# Altium schematic sheet Copy of uARM.SchDoc
size B
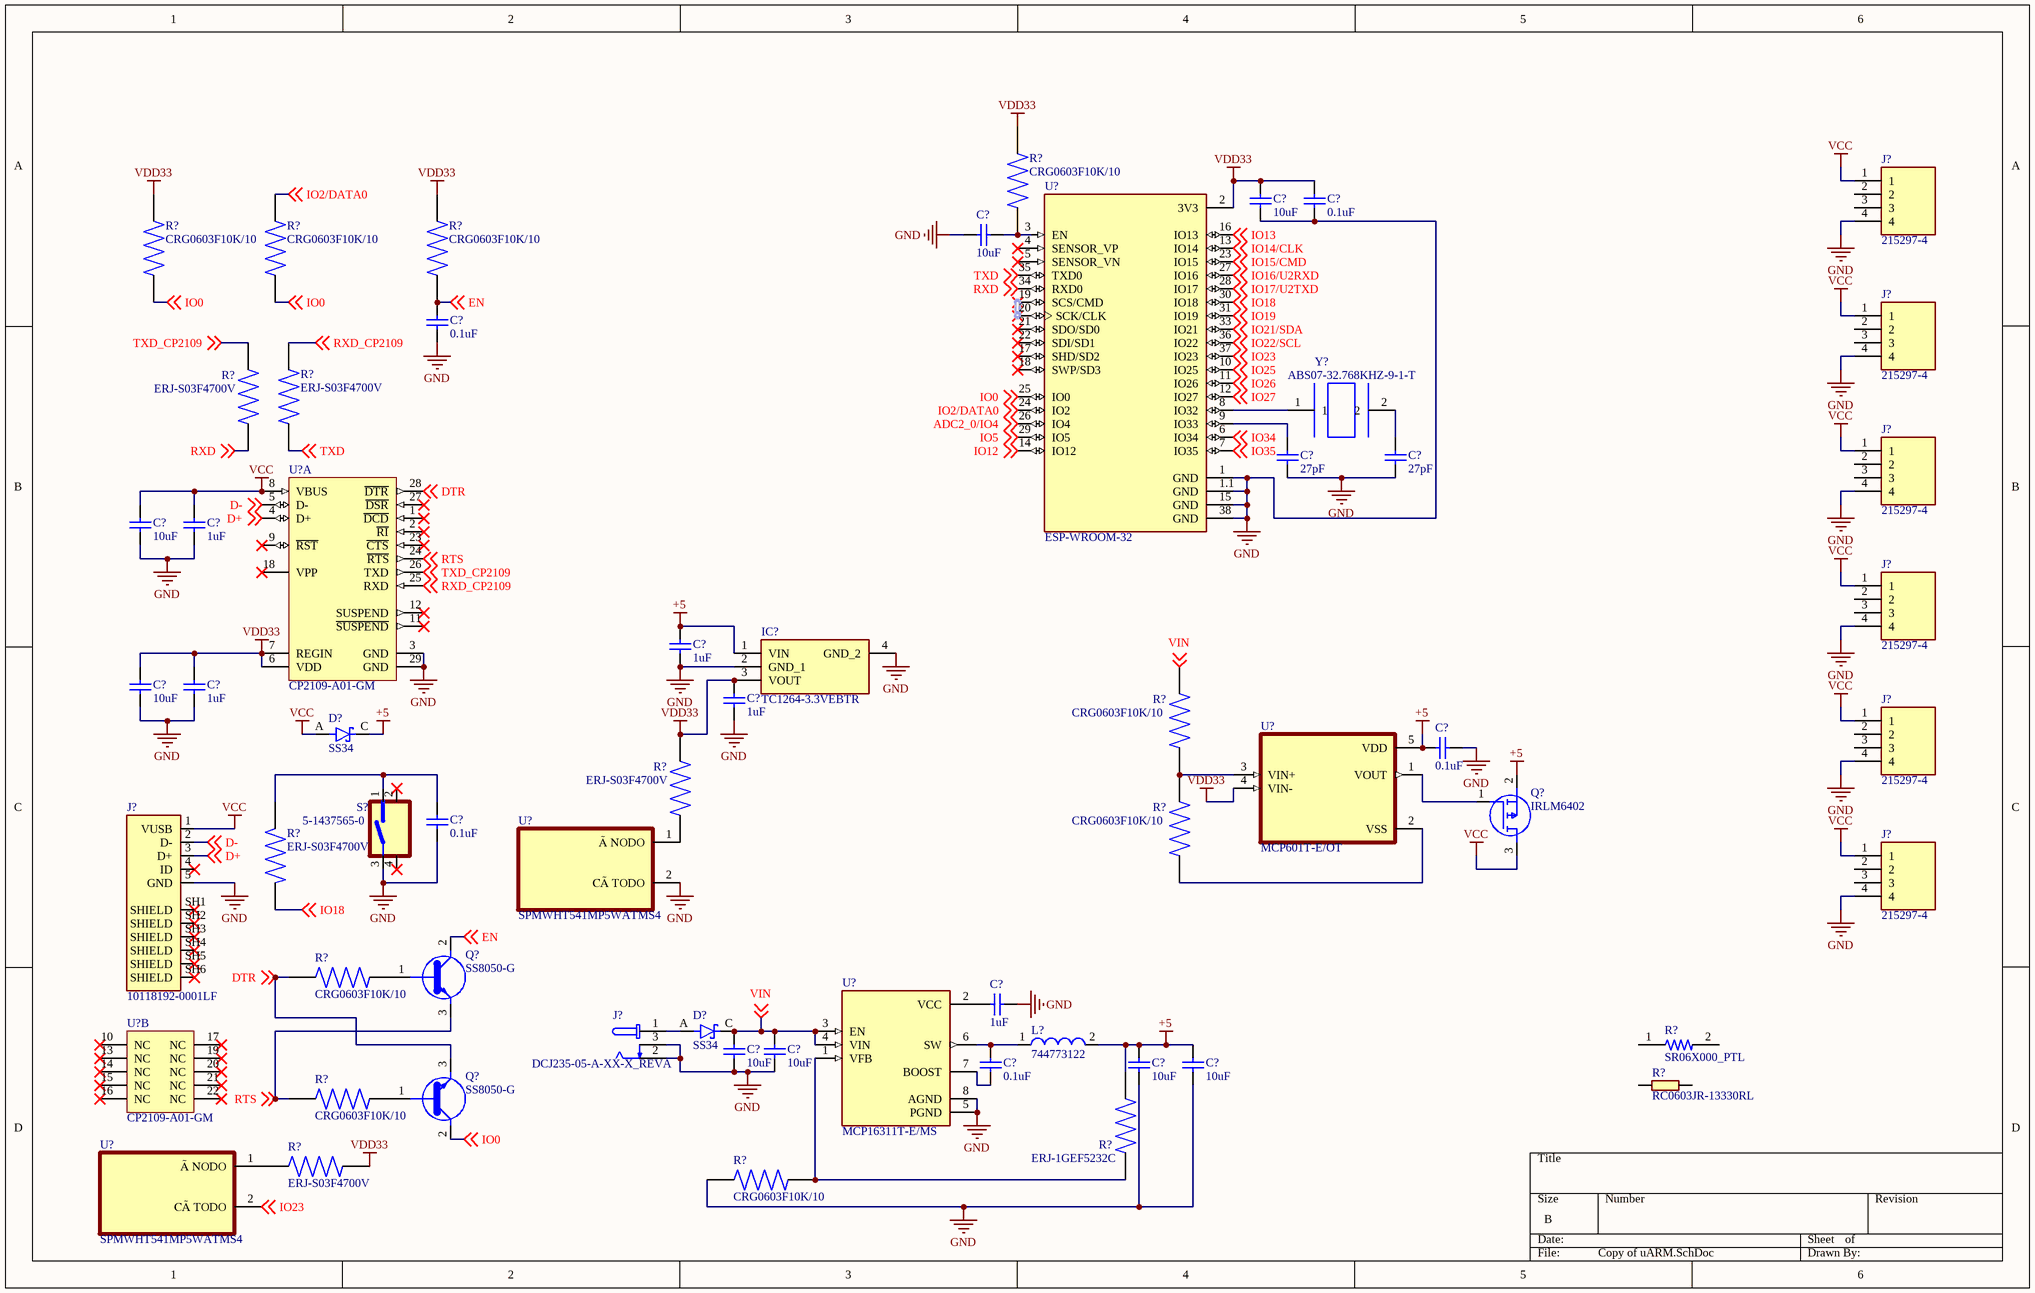
[diagram p0: Copy of uARM.SchDoc]

## Parts
(Parts that share a designator on the sheet are numbered #1, #2 ... from top to bottom, then left to right.)
C?#1  value 10uF  [C_3216[1206]_N]  (hidden comment: C1206C106K3RACTU)
C?#2  value 0.1uF  [C_3216[1206]_N]  (hidden comment: C1206C106K3RACTU)
C?#3  value 10uF  [C_3216[1206]_N]  (hidden comment: C1206C106K3RACTU)
C?#4  value 0.1uF  [C_3216[1206]_N]  (hidden comment: C1206C106K3RACTU)
C?#5  value 27pF  [C_3216[1206]_N]  (hidden comment: C1206C106K3RACTU)
C?#6  value 27pF  [C_3216[1206]_N]  (hidden comment: C1206C106K3RACTU)
C?#7  value 10uF  [C_3216[1206]_N]  (hidden comment: C1206C106K3RACTU)
C?#8  value 1uF  [C_3216[1206]_N]  (hidden comment: C1206C106K3RACTU)
C?#9  value 1uF  [C_3216[1206]_N]  (hidden comment: C1206C106K3RACTU)
C?#10  value 1uF  [C_3216[1206]_N]  (hidden comment: C1206C106K3RACTU)
C?#11  value 10uF  [C_3216[1206]_N]  (hidden comment: C1206C106K3RACTU)
C?#12  value 1uF  [C_3216[1206]_N]  (hidden comment: C1206C106K3RACTU)
C?#13  value 0.1uF  [C_3216[1206]_N]  (hidden comment: C1206C106K3RACTU)
C?#14  value 0.1uF  [C_3216[1206]_N]  (hidden comment: C1206C106K3RACTU)
C?#15  value 1uF  [C_3216[1206]_N]  (hidden comment: C1206C106K3RACTU)
C?#16  value 10uF  [C_3216[1206]_N]  (hidden comment: C1206C106K3RACTU)
C?#17  value 10uF  [C_3216[1206]_N]  (hidden comment: C1206C106K3RACTU)
C?#18  value 0.1uF  [C_3216[1206]_N]  (hidden comment: C1206C106K3RACTU)
C?#19  value 10uF  [C_3216[1206]_N]  (hidden comment: C1206C106K3RACTU)
C?#20  value 10uF  [C_3216[1206]_N]  (hidden comment: C1206C106K3RACTU)
D?#1  SS34  [DIOM7959X265N]
D?#2  SS34  [DIOM7959X265N]
IC?  TC1264-3.3VEBTR  [TC126433VEBTR]
J?#1  215297-4  [TE_215297-4]
J?#2  215297-4  [TE_215297-4]
J?#3  215297-4  [TE_215297-4]
J?#4  215297-4  [TE_215297-4]
J?#5  215297-4  [TE_215297-4]
J?#6  10118192-0001LF  [AMPHENOL_10118192-0001LF]
J?#7  215297-4  [TE_215297-4]
J?#8  DCJ235-05-A-XX-X_REVA  [GCT_DCJ235-05-A-XX-X_REVA]
L?  744773122  [WE-PD2-S]
Q?#1  IRLM6402  [SOT95P237X112-3N]
Q?#2  SS8050-G  [MBTB-T-SOT23]
Q?#3  SS8050-G  [MBTB-T-SOT23]
R?#1  CRG0603F10K/10  [RESC1608X55N]
R?#2  CRG0603F10K/10  [RESC1608X55N]
R?#3  CRG0603F10K/10  [RESC1608X55N]
R?#4  CRG0603F10K/10  [RESC1608X55N]
R?#5  ERJ-S03F4700V  [RESC1608X55N]
R?#6  ERJ-S03F4700V  [RESC1608X55N]
R?#7  CRG0603F10K/10  [RESC1608X55N]
R?#8  ERJ-S03F4700V  [RESC1608X55N]
R?#9  CRG0603F10K/10  [RESC1608X55N]
R?#10  ERJ-S03F4700V  [RESC1608X55N]
R?#11  CRG0603F10K/10  [RESC1608X55N]
R?#12  SR06X000_PTL  [RESC1608X55]
R?#13  RC0603JR-13330RL  [0603]
R?#14  CRG0603F10K/10  [RESC1608X55N]
R?#15  ERJ-1GEF5232C  [RESC0603X26N]
R?#16  ERJ-S03F4700V  [RESC1608X55N]
R?#17  CRG0603F10K/10  [RESC1608X55N]
S?  5-1437565-0  [SW_5-1437565-0]
U?#1  ESP-WROOM-32  [MODULE_ESP-WROOM-32]
U?#2  CP2109-A01-GM  [SLAB-QFN-28-3125x3125TP_L]  (part A of 2)
U?#3  MCP601T-E/OT  [SOT95P270X145-5N]
U?#4  SPMWHT541MP5WATMS4  [LED_SPMWHT541MP5WAPKS4]
U?#5  CP2109-A01-GM  [SLAB-QFN-28-3125x3125TP_L]  (part B of 2)
U?#6  MCP16311T-E/MS  [SOP65P490X110-8N]
U?#7  SPMWHT541MP5WATMS4  [LED_SPMWHT541MP5WAPKS4]
Y?  ABS07-32.768KHZ-9-1-T  [XTAL320X150X90]

## Nets
+5: C?#9.1 C?#13.2 C?#19.2 C?#20.2 D?#1.C(K) IC?.1(VIN) L?.2 Q?#1.2(S) R?#15.2 U?#3.5(VDD)
GND: C?#1.1 C?#2.1 C?#3.2 C?#4.1 C?#5.1 C?#6.1 C?#7.1 C?#8.1 C?#9.2 C?#10.2 C?#11.1 C?#12.1 C?#13.1 C?#14.1 C?#15.1 C?#16.1 C?#17.1 C?#19.1 C?#20.1 IC?.2(GND_1) IC?.4(GND_2) J?#1.4 J?#2.4 J?#3.4 J?#4.4 J?#5.4 J?#6.5(GND) J?#7.4 J?#8.2 J?#8.3 R?#17.1 S?.3 U?#1.1(GND) U?#1.1.1(GND) U?#1.15(GND) U?#1.38(GND) U?#2.3(GND) U?#2.29(GND) U?#4.2(CÃTODO) U?#6.5(PGND) U?#6.8(AGND)
VCC: C?#7.2 C?#8.2 D?#1.A J?#1.1 J?#2.1 J?#3.1 J?#4.1 J?#5.1 J?#6.1(VUSB) J?#7.1 Q?#1.3(D) U?#2.8(VBUS)
VDD33: C?#1.2 C?#2.2 C?#10.1 C?#11.2 C?#12.2 IC?.3(VOUT) R?#1.2 R?#2.1 R?#4.1 R?#8.2 R?#16.1 U?#1.2(3V3) U?#2.6(VDD) U?#2.7(REGIN) U?#3.4(VIN-)
ADC2_0/IO4: U?#1.26(IO4) ; off-sheet ADC2_0/IO4
D+: J?#6.3(D+) U?#2.4(D+) ; off-sheet D+
D-: J?#6.2(D-) U?#2.5(D-) ; off-sheet D-
DTR: Q?#3.3(C) R?#11.2 U?#2.28(~{DTR}) ; off-sheet DTR
EN: C?#4.2 Q?#2.2(E) R?#4.2 ; off-sheet EN
IO0: Q?#3.2(E) R?#2.2 R?#3.2 U?#1.25(IO0) ; off-sheet IO0
IO2/DATA0: R?#3.1 U?#1.24(IO2) ; off-sheet IO2/DATA0
IO5: U?#1.29(IO5) ; off-sheet IO5
IO12: U?#1.14(IO12) ; off-sheet IO12
IO13: U?#1.16(IO13) ; off-sheet IO13
IO14/CLK: U?#1.13(IO14) ; off-sheet IO14/CLK
IO15/CMD: U?#1.23(IO15) ; off-sheet IO15/CMD
IO16/U2RXD: U?#1.27(IO16) ; off-sheet IO16/U2RXD
IO17/U2TXD: U?#1.28(IO17) ; off-sheet IO17/U2TXD
IO18: R?#10.2 U?#1.30(IO18) ; off-sheet IO18
IO19: U?#1.31(IO19) ; off-sheet IO19
IO21/SDA: U?#1.33(IO21) ; off-sheet IO21/SDA
IO22/SCL: U?#1.36(IO22) ; off-sheet IO22/SCL
IO23: U?#1.37(IO23) U?#7.2(CÃTODO) ; off-sheet IO23
IO25: U?#1.10(IO25) ; off-sheet IO25
IO26: U?#1.11(IO26) ; off-sheet IO26
IO27: U?#1.12(IO27) ; off-sheet IO27
IO34: U?#1.6(IO34) ; off-sheet IO34
IO35: U?#1.7(IO35) ; off-sheet IO35
RTS: Q?#2.3(C) R?#14.2 U?#2.24(~{RTS}) ; off-sheet RTS
RXD: R?#5.1 U?#1.34(RXD0) ; off-sheet RXD
RXD_CP2109: R?#6.2 U?#2.25(RXD) ; off-sheet RXD_CP2109
TXD: R?#6.1 U?#1.35(TXD0) ; off-sheet TXD
TXD_CP2109: R?#5.2 U?#2.26(TXD) ; off-sheet TXD_CP2109
VIN: C?#16.2 C?#17.2 D?#2.C(K) R?#7.1 U?#6.3(EN) U?#6.4(VIN) ; off-sheet VIN
NetC?#3_1: C?#3.1 R?#1.1 U?#1.3(EN)
NetC?#5_2: C?#5.2 U?#1.9(IO33)
NetC?#6_2: C?#6.2 Y?.2
NetC?#14_2: C?#14.2 R?#10.1 S?.1
NetC?#15_2: C?#15.2 U?#6.2(VCC)
NetC?#18_1: C?#18.1 U?#6.7(BOOST)
NetC?#18_2: C?#18.2 L?.1 U?#6.6(SW)
NetD?#2_A: D?#2.A J?#8.1
NetQ?#1_1: Q?#1.1(G) U?#3.1(VOUT)
NetQ?#2_1: Q?#2.1(B) R?#11.1
NetQ?#3_1: Q?#3.1(B) R?#14.1
NetR?#7_2: R?#7.2 R?#9.1 U?#3.3(VIN+)
NetR?#8_1: R?#8.1 U?#4.1(ÃNODO)
NetR?#9_2: R?#9.2 U?#3.2(VSS)
NetR?#15_1: R?#15.1 R?#17.2 U?#6.1(VFB)
NetR?#16_2: R?#16.2 U?#7.1(ÃNODO)
NetU?#1_8: U?#1.8(IO32) Y?.1

Not connected (* = marked no-connect by the designer): J?#1 2 3; J?#2 2 3; J?#3 2 3; J?#4 2 3; J?#5 2 3; J?#6 4(ID)* SH1(SHIELD)* SH2(SHIELD)* SH3(SHIELD)* SH4(SHIELD)* SH5(SHIELD)* SH6(SHIELD)*; J?#7 2 3; R?#12 1 2; R?#13 1 2; S? 2* 4(1)*; U?#1 4(SENSOR_VP)* 5(SENSOR_VN)* 17(SHD/SD2)* 18(SWP/SD3)* 19(SCS/CMD)* 20(SCK/CLK)* 21(SDO/SD0)* 22(SDI/SD1)*; U?#2 1(~{DCD})* 2(~{RI})* 9(~{RST})* 11(~{SUSPEND})* 12(SUSPEND)* 18(VPP)* 23(~{CTS})* 27(~{DSR})*; U?#5 10(NC)* 13(NC)* 14(NC)* 15(NC)* 16(NC)* 17(NC)* 19(NC)* 20(NC)* 21(NC)* 22(NC)*

## Library data of the parts
C?#1-C?#20 = C_10uf_3216[1206]: Capacitor Céramique 10uf XR7 25V 10%; Manufacturer: KEMET; ManufacturerPartNumber: C1206C106K3RACTU; Supplier 1: Digi-Key; Supplier Part Number 1: 399-7442-1-ND; MountingType: SMT
D?#1 D?#2 = SS34: Diode Schottky 40V 3A 2-Pin SMC T/R; MF: {'manufacturer': u'ON Semiconductor'}; Availability: Unavailable; Package: None; MP: SS34; Value: *; Price: None
IC? = TC1264-3.3VEBTR: Integrated Circuit; Manufacturer_Name: Microchip; Datasheet Link: http://ww1.microchip.com/downloads/en/devicedoc/21375d.pdf; Height: 4.572mm; Manufacturer_Part_Number: TC1264-3.3VEBTR; Mouser Part Number: 579-TC1264-3.3VEBTR; Mouser Price/Stock: https://www.mouser.com/Search/Refine.aspx?Keyword=579-TC1264-3.3VEBTR
J?#1-J?#5 J?#7 = 215297-4: MF: {'manufacturer': u'TE Connectivity'}; Package: None; Price: None; Availability: Unavailable; MP: 215297-4; Value: *
J?#6 = 10118192-0001LF: Single Port 5 Contact Horizontal Right Angle Shielded Micro B USB 2.0 Connector; MF: {'manufacturer': u'FCI'}; Package: None; MP: 10118192-0001LF; Price: None; Value: *; Availability: Unavailable
J?#8 = DCJ235-05-A-XX-X_REVA: DC Power Jack, Thru-Hole, Horizontal, with Locating Pegs, D2.35mm; MF: {'manufacturer': u'Global Connector Technology'}; Availability: Unavailable; Package: None; Price: None; MP: DCJ235-05-A-XX-X_REVA; Value: *
L? = 744773122: SMD Power Inductor WE-PD2, L = 22.0 µH; Inductance: 22.0 ÂµH; ComponentLink1Description: Manufacturer Link; ComponentLink2Description: Datasheet; DatasheetVersion: ver 1, Oct-2004; ComponentLink1URL: http://www.we-online.com; PackageVersion: 2004; PackageDescription: SMD Inductor, 2-Leads, Body 4.5 x 4.0 mm; ComponentLink2URL: http://www.we-online.de/katalog/media/pdf/744773122.pdf; PackageReference: WE-PD2-S; PartNumber: 744773122
Q?#1 = IRLM6402: MOSFET (P-Channel); Manufacturer_Name: Infineon; Datasheet Link: https://www.kynix.com/Detail/613549/IRLM6402.html; Height: 1.12mm; Manufacturer_Part_Number: IRLM6402
Q?#2 Q?#3 = SS8050-G: <b>Bipolar Transistors - BJT NPN TRANSISTOR 1.5A 40V</b><p> Source: <a href="https://componentsearchengine.com/Datasheets/1/SS8050-G.pdf"> Datasheet </a>; MF: {'manufacturer': u'Comchip Technology'}; Package: None; Value: *; MP: SS8050-G; Availability: Unavailable; Price: None
R?#1-R?#4 R?#7 R?#9 R?#11 R?#14 R?#17 = CRG0603F10K/10: Thick Film Resistors - SMD CRG0603 1% 10K 10K RL; MF: {'manufacturer': u'TE Connectivity'}; Value: *; Price: None; MP: CRG0603F10K/10; Package: None; Availability: Unavailable
R?#5 R?#6 R?#8 R?#10 R?#16 = ERJ-S03F4700V: MF: {'manufacturer': u'Panasonic'}; Package: None; Value: *; Price: None; MP: ERJ-S03F4700V; Availability: Unavailable
R?#12 = SR06X000_PTL: MP: SR06X000 PTL; MF: {'manufacturer': u'Walsin Technologies'}; Price: None; Package: None; Value: *; Availability: Unavailable
R?#13 = RC0603JR-13330RL: https://octopart.com/rc0603fr-13100kl-yageo-12819546; MF: {'manufacturer': u'Yageo'}; MP: RC0603JR-13330RL; Price: None; Package: None; Value: *; Availability: Unavailable
R?#15 = ERJ-1GEF5232C: Res Thick Film 0201 52.3K Ohm 1% 0.05W(1/20W) Â±200ppm/C SMD T/R; MF: {'manufacturer': u'Panasonic'}; Package: None; MP: ERJ-1GEF5232C; Value: *; Availability: Unavailable; Price: None
S? = 5-1437565-0: Switch Tactile OFF (ON) Round Button Gull Wing 0.05A 12VDC 1.57N SMD T/R; MF: {'manufacturer': u'TE Connectivity'}; MP: 5-1437565-0; Package: None; Price: None; Value: *; Availability: Unavailable
U?#1 = ESP-WROOM-32: Module: combo; GPIO, I2C x2, I2S x2, SDIO, SPI x3, UART x3; 19.5dBm; MF: {'manufacturer': u'Espressif Systems'}; Availability: Unavailable; MP: ESP-WROOM-32; Value: *; Price: None; Package: None
U?#2 U?#5 = CP2109-A01-GM: Single-Chip USB to UART Bridge, 1024 Bytes EEPROM, -40 to 85 degC, 28-pin QFN, Tube; Manufacturer: Silicon Labs; Sub-Family: USB Bridges; Internal Oscillator: TRUE; ComponentLink1Description: Manufacturer URL; ComponentLink2Description: Datasheet; PartNumber: CP2109-A01-GM; ComponentLink3Description: Package Specification; ComponentLink3URL: http://www.silabs.com/Support%20Documents/TechnicalDocs/C8051T61x.pdf; DatasheetVersion: Rev. 1.5; ComponentLink1URL: http://www.silabs.com/; ComponentLink2URL: http://www.silabs.com/Support%20Documents/TechnicalDocs/CP2102-9.pdf; Code_IPC: J-STD-020C; Mounting Technology: Surface Mount; PackageDescription: 28-Pin Quad-Flat No-Leads Package, Body 5 x 5 mm, Pitch 0.5 mm; Code_JEDEC: MO-220; EEPROM: 1024 Bytes; PackageReference: QFN-28
U?#3 = MCP601T-E/OT: MF: {'manufacturer': u'Microchip'}; Package: None; MP: MCP601T-E/OT; Price: None; Value: *; Availability: Unavailable
U?#4 U?#7 = SPMWHT541MP5WATMS4: MF: {'manufacturer': u'Samsung Semiconductor,'}; Package: None; Value: *; MP: SPMWHT541MP5WATMS4; Availability: Unavailable; Price: None
U?#6 = MCP16311T-E/MS: The MCP16311/2 is a compact, high-efficiency, fixed frequency, synchronous step-down DC-DC converter in an 8-pin MSOP, or 2 x 3 TDFN package that operates from input voltage sources up to 30V. Integrated features include a high-side and a low-side switch, fixed frequency peak current mode control, internal compensation, peak current limit and overtemperature protection. The MCP16311/2 provides all the active functions for local DC-DC conversion, with fast transient response and accurate regulation.; MF: {'manufacturer': u'Microchip Technology'}; MP: MCP16311T-E/MS; Value: *; Package: None; Price: None; Availability: Unavailable
Y? = ABS07-32.768KHZ-9-1-T: ABS07 Series 32.768 kHz Â±20 ppm 12.5 pF -40 to +85 C SMT Low Profile Crystal; MF: {'manufacturer': u'Abracon'}; Package: None; MP: ABS07-32.768KHZ-9-1-T; Price: None; Value: *; Availability: Unavailable